# EasyEDA schematic UV_LED_IPEX4.json
TITLE: Sheet_1; REV: 1.0; Date: 2023-10-01; Sheet: 1/1; Drawn By: AmirB; Company: Your Company
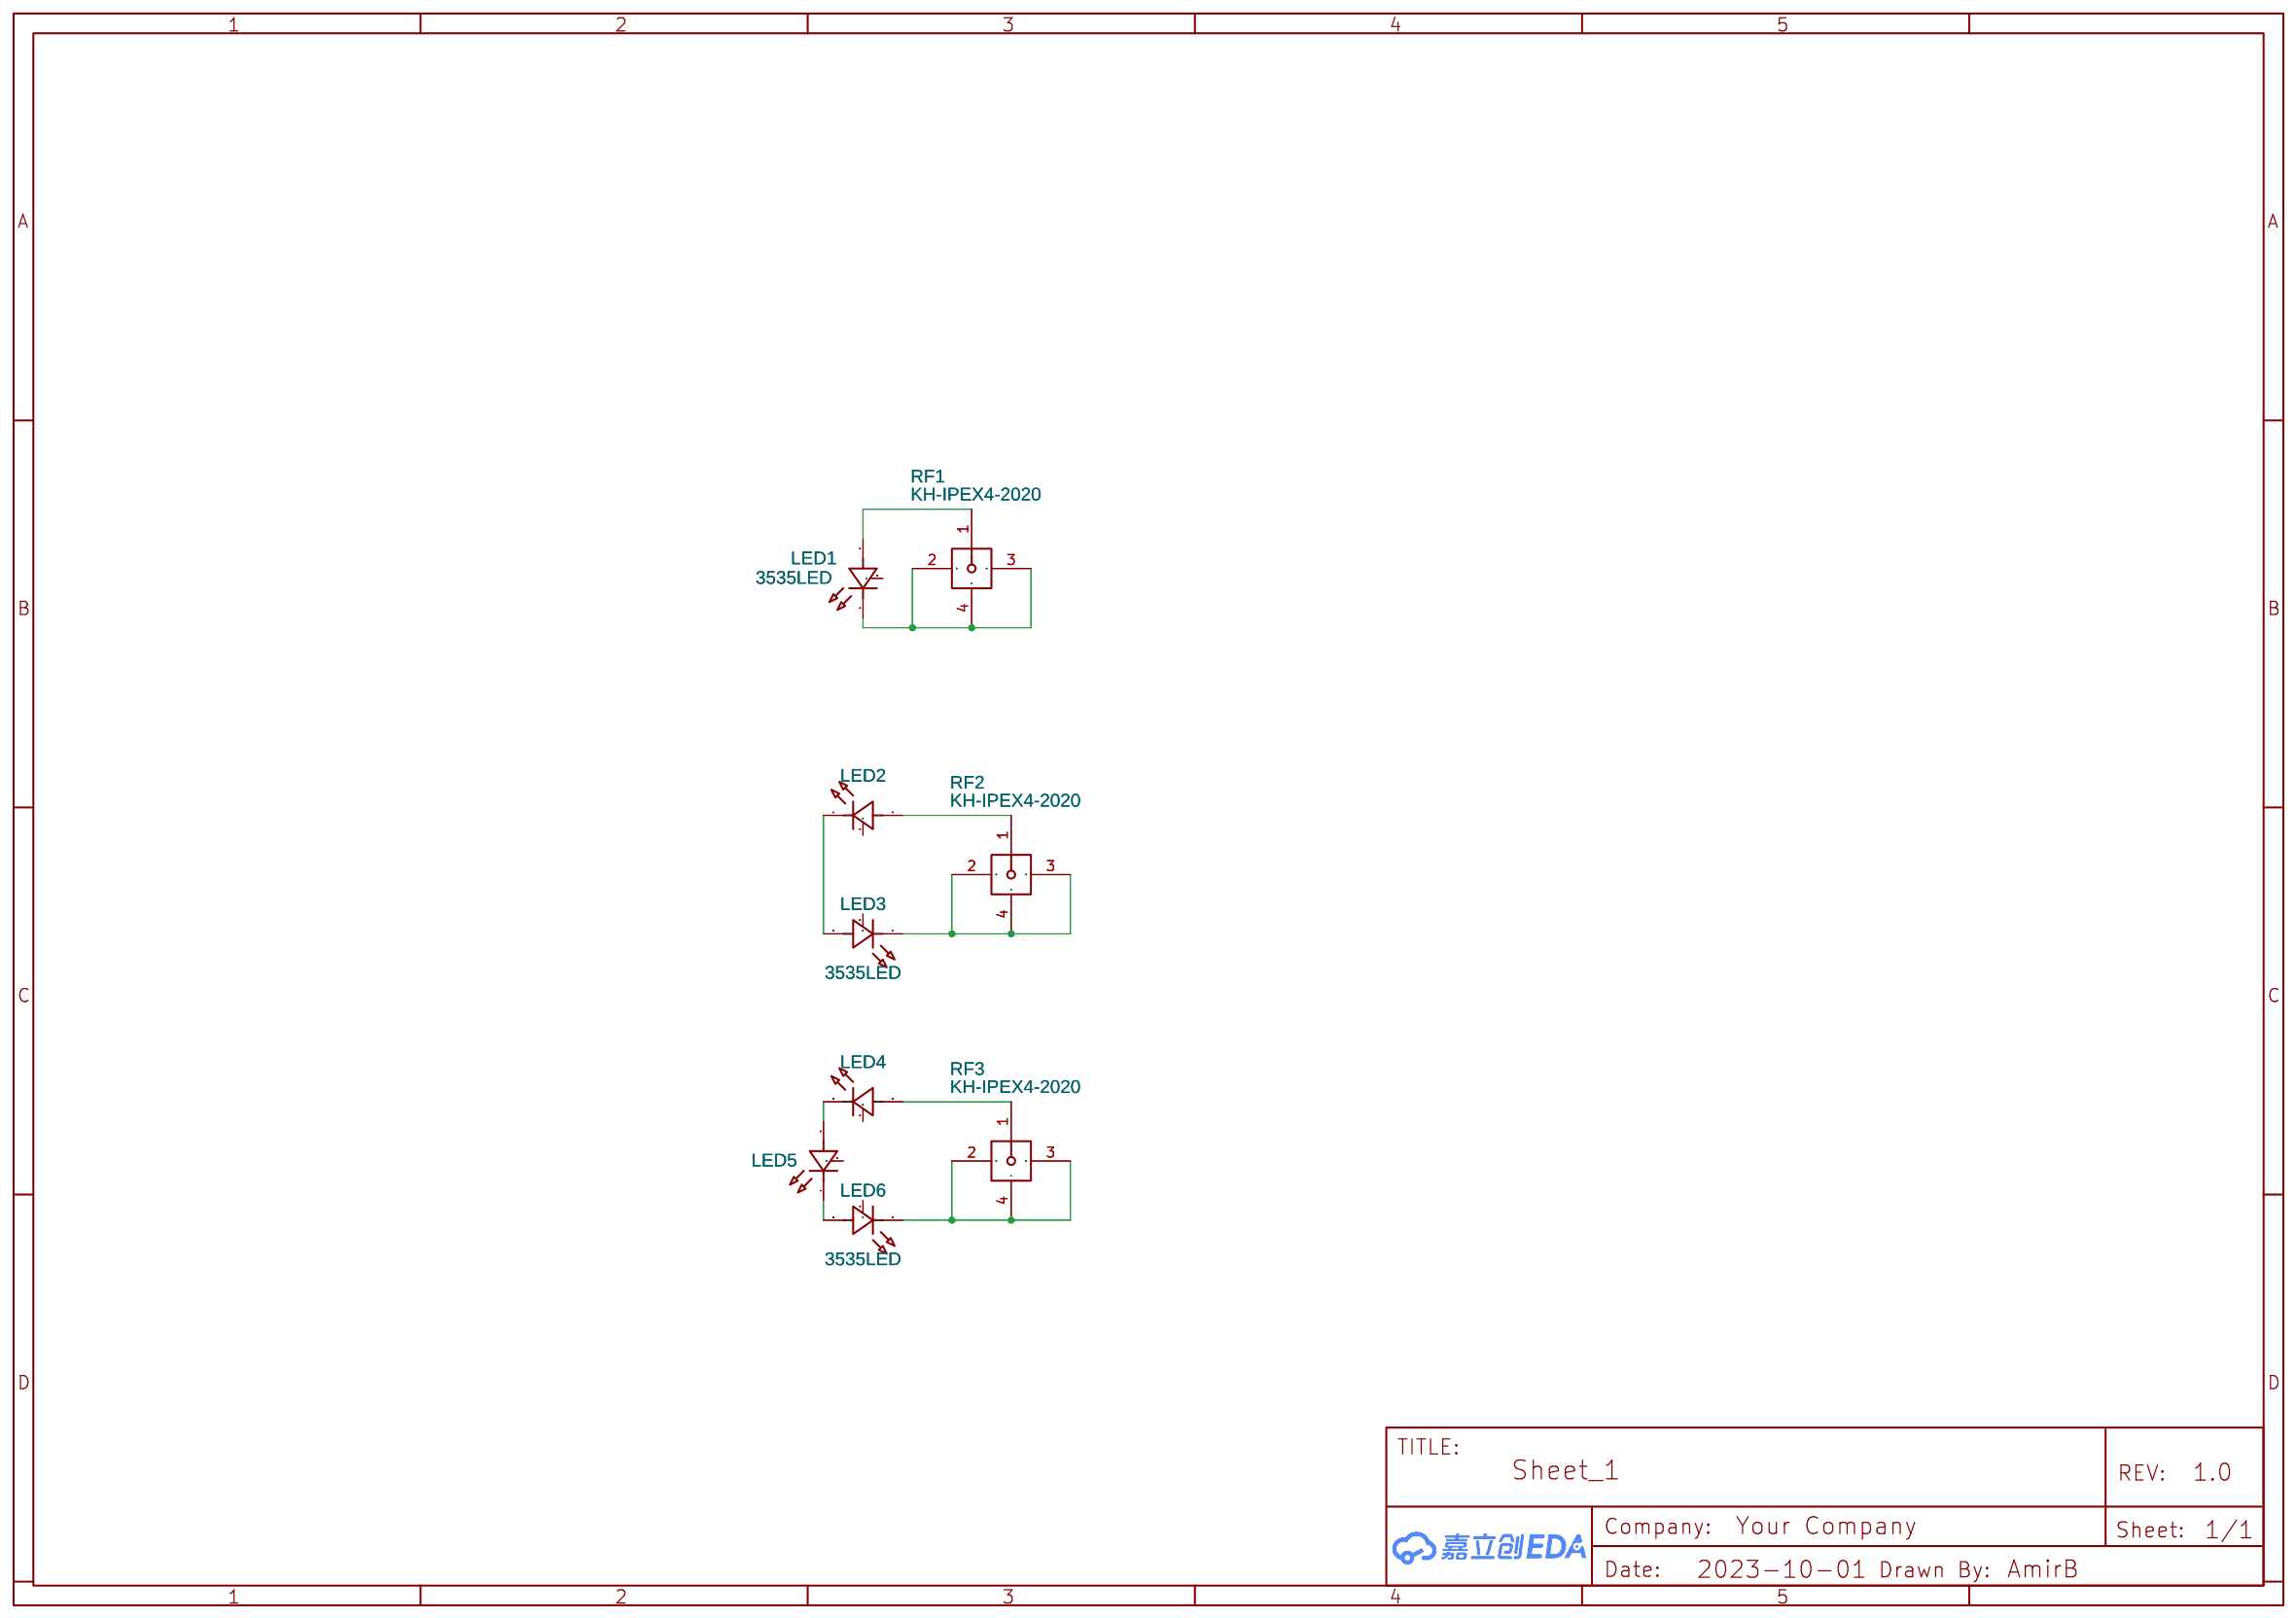
[diagram p0: schematic sheet]

## Parts
LED1  3535LED  [LED-SMD_3P-L3.5-W3.5_M3535O1IRS13G06]
LED2  3535LED  [LED-SMD_3P-L3.5-W3.5_M3535O1IRS13G06]
LED3  3535LED  [LED-SMD_3P-L3.5-W3.5_M3535O1IRS13G06]
LED4  3535LED  [LED-SMD_3P-L3.5-W3.5_M3535O1IRS13G06]
LED5  3535LED  [LED-SMD_3P-L3.5-W3.5_M3535O1IRS13G06]
LED6  3535LED  [LED-SMD_3P-L3.5-W3.5_M3535O1IRS13G06]
RF1  KH-IPEX4-2020  [IPEX4-SMD_4P-L1.8-W1.7-LS2.0-L_KH-IPEX4-2020]
RF2  KH-IPEX4-2020  [IPEX4-SMD_4P-L1.8-W1.7-LS2.0-L_KH-IPEX4-2020]
RF3  KH-IPEX4-2020  [IPEX4-SMD_4P-L1.8-W1.7-LS2.0-L_KH-IPEX4-2020]

## Library data of the parts
LED1-LED6 = M3535N1UVS8U06-365NM: Supplier: LCSC; Supplier Part: C2833503; Manufacturer: Silverlight(银月光); Manufacturer Part: M3535N1UVS8U06-365nm; JLCPCB Part Class: Extended Part; Contributor: LCSC
RF1-RF3 = KH-IPEX4-2020: Contributor: LCSC; Supplier: LCSC; Supplier Part: C530666; Manufacturer: kinghelm(金航标); JLCPCB Part Class: Extended Part; Package Display: No

## Nets
Net-(LED1-1): LED1.1(K) RF1.2 RF1.3 RF1.4
Net-(LED1-2): LED1.2(A) RF1.1
Net-(LED2-1): LED2.1(K) LED3.2(A)
Net-(LED2-2): LED2.2(A) RF2.1
Net-(LED3-1): LED3.1(K) RF2.2 RF2.3 RF2.4
Net-(LED4-1): LED4.1(K) LED5.2(A)
Net-(LED4-2): LED4.2(A) RF3.1
Net-(LED5-1): LED5.1(K) LED6.2(A)
Net-(LED6-1): LED6.1(K) RF3.2 RF3.3 RF3.4

Not connected (* = marked no-connect by the designer): LED1 3; LED2 3; LED3 3; LED4 3; LED5 3; LED6 3
